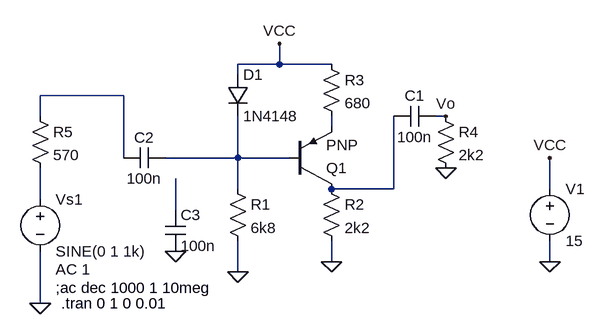
[diagram p0: schematic Draft1.asc]
Draft1.asc, the LTspice schematic file:
Version 4
SHEET 1 880 680
WIRE 128 48 128 16
WIRE 128 48 64 48
WIRE 208 48 128 48
WIRE 64 64 64 48
WIRE -112 96 -240 96
WIRE -240 128 -240 96
WIRE 384 128 368 128
WIRE 208 144 208 128
WIRE -112 192 -112 96
WIRE 64 192 64 128
WIRE 64 192 -48 192
WIRE 144 192 64 192
WIRE 64 240 64 192
WIRE 304 240 304 128
WIRE 304 240 208 240
WIRE 544 240 544 192
WIRE -240 256 -240 208
WIRE -32 272 -32 224
WIRE 208 352 208 320
WIRE 544 352 544 320
WIRE 64 368 64 320
WIRE -240 416 -240 336
FLAG 64 368 0
FLAG 208 352 0
FLAG 128 16 VCC
FLAG 384 128 Vo
FLAG 384 208 0
FLAG -240 416 0
FLAG 544 352 0
FLAG 544 192 VCC
FLAG -32 336 0
SYMBOL res 48 224 R0
SYMATTR InstName R1
SYMATTR Value 6k8
SYMBOL pnp 144 240 M180
SYMATTR InstName Q1
SYMBOL res 192 224 R0
SYMATTR InstName R2
SYMATTR Value 2k2
SYMBOL diode 48 64 R0
SYMATTR InstName D1
SYMATTR Value 1N4148
SYMBOL res 192 32 R0
SYMATTR InstName R3
SYMATTR Value 680
SYMBOL cap 368 112 R90
WINDOW 0 0 32 VBottom 2
WINDOW 3 32 32 VTop 2
SYMATTR InstName C1
SYMATTR Value 100n
SYMBOL res 368 112 R0
SYMATTR InstName R4
SYMATTR Value 2k2
SYMBOL cap -48 176 R90
WINDOW 0 0 32 VBottom 2
WINDOW 3 32 32 VTop 2
SYMATTR InstName C2
SYMATTR Value 100n
SYMBOL res -256 112 R0
SYMATTR InstName R5
SYMATTR Value 570
SYMBOL voltage -240 240 R0
WINDOW 123 24 124 Left 2
WINDOW 39 0 0 Left 0
SYMATTR InstName Vs1
SYMATTR Value SINE(0 1 1k)
SYMATTR Value2 AC 1
SYMBOL voltage 544 224 R0
WINDOW 123 0 0 Left 0
WINDOW 39 0 0 Left 0
SYMATTR InstName V1
SYMATTR Value 15
SYMBOL cap -48 272 R0
SYMATTR InstName C3
SYMATTR Value 100n
TEXT -216 392 Left 2 !;ac dec 1000 1 10meg
TEXT -208 416 Left 2 !.tran 0 1 0 0.01

The netlist it stands for:
* Draft1.asc
R1 N003 0 6k8
Q1 N004 N003 N002 0 PNP
R2 N004 0 2k2
D1 VCC N003 1N4148
R3 VCC N002 680
C1 Vo N004 100n
R4 Vo 0 2k2
C2 N003 N001 100n
R5 N001 N005 570
Vs1 N005 0 SINE(0 1 1k) AC 1
V1 VCC 0 15
C3 N006 0 100n
.model D D
.lib standard.dio
.model NPN NPN
.model PNP PNP
.lib standard.bjt
;ac dec 1000 1 10meg
.tran 0 1 0 0.01
.backanno
.end